# Altium schematic sheet Telemetry_Modul.SchDoc
size Letter; SheetNumber: 11; SheetTotal: 18
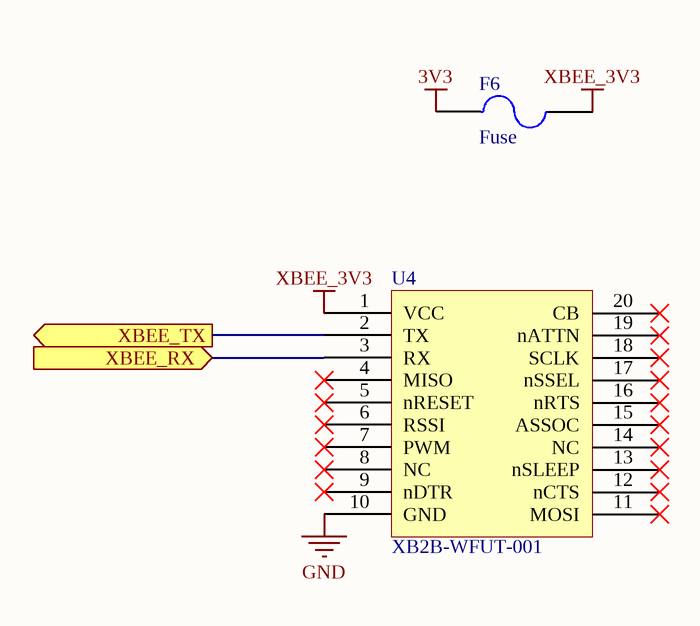
[diagram p0: Telemetry_Modul.SchDoc]

## Parts
F6  Fuse  [F_0603]
U4  XB2B-WFUT-001  [XBee (WiFi)]

## Ports
XBEE_RX (in), XBEE_TX (out)

## Nets
3V3: F6.1
GND: U4.10(GND)
XBEE_3V3: F6.2 U4.1(VCC)
XBEE_RX: U4.3(RX) ; port XBEE_RX
XBEE_TX: U4.2(TX) ; port XBEE_TX

Not connected (* = marked no-connect by the designer): U4 4(MISO)* 5(nRESET)* 6(RSSI)* 7(PWM)* 8(NC)* 9(nDTR)* 11(MOSI)* 12(nCTS)* 13(nSLEEP)* 14(NC)* 15(ASSOC)* 16(nRTS)* 17(nSSEL)* 18(SCLK)* 19(nATTN)* 20(CB)*

## Library data of the parts
F6 = Oth_MC06CF.500_F_0603: NI part number: 766324-01; Order number: 1841006; Rating: 32VDC; Type: Very Fast Acting Fuse; Value: 500mA; NI PEN/DEB: DEB; Distributor: Farnell; ID: Oth_MC06CF.500_F_0603; Link: http://hu.farnell.com/multicomp/mc06cf-500/fuse-smd-0603-0-5a/dp/1841006; Package: F_0603; Part Number: MC06CF.500; Price (HUF): 125
U4 = XBee: Order number: 2343884; Distributor: Farnell; Link: http://hu.farnell.com/digi-international/xb2b-wfut-001/mod-xbee-2-4ghz-wifi-u-fl-conn/dp/2343884?ost=2343884; Part Number: XB2B-WFUT-001; Price (HUF): 12000